# EAGLE design Shield_3up (EAGLE 9.4.0)
COMPANY: Unexpected Maker; DATE: 24-10-2018; DRAWN: Seon; REV: V1; TITLE: TinyPICO
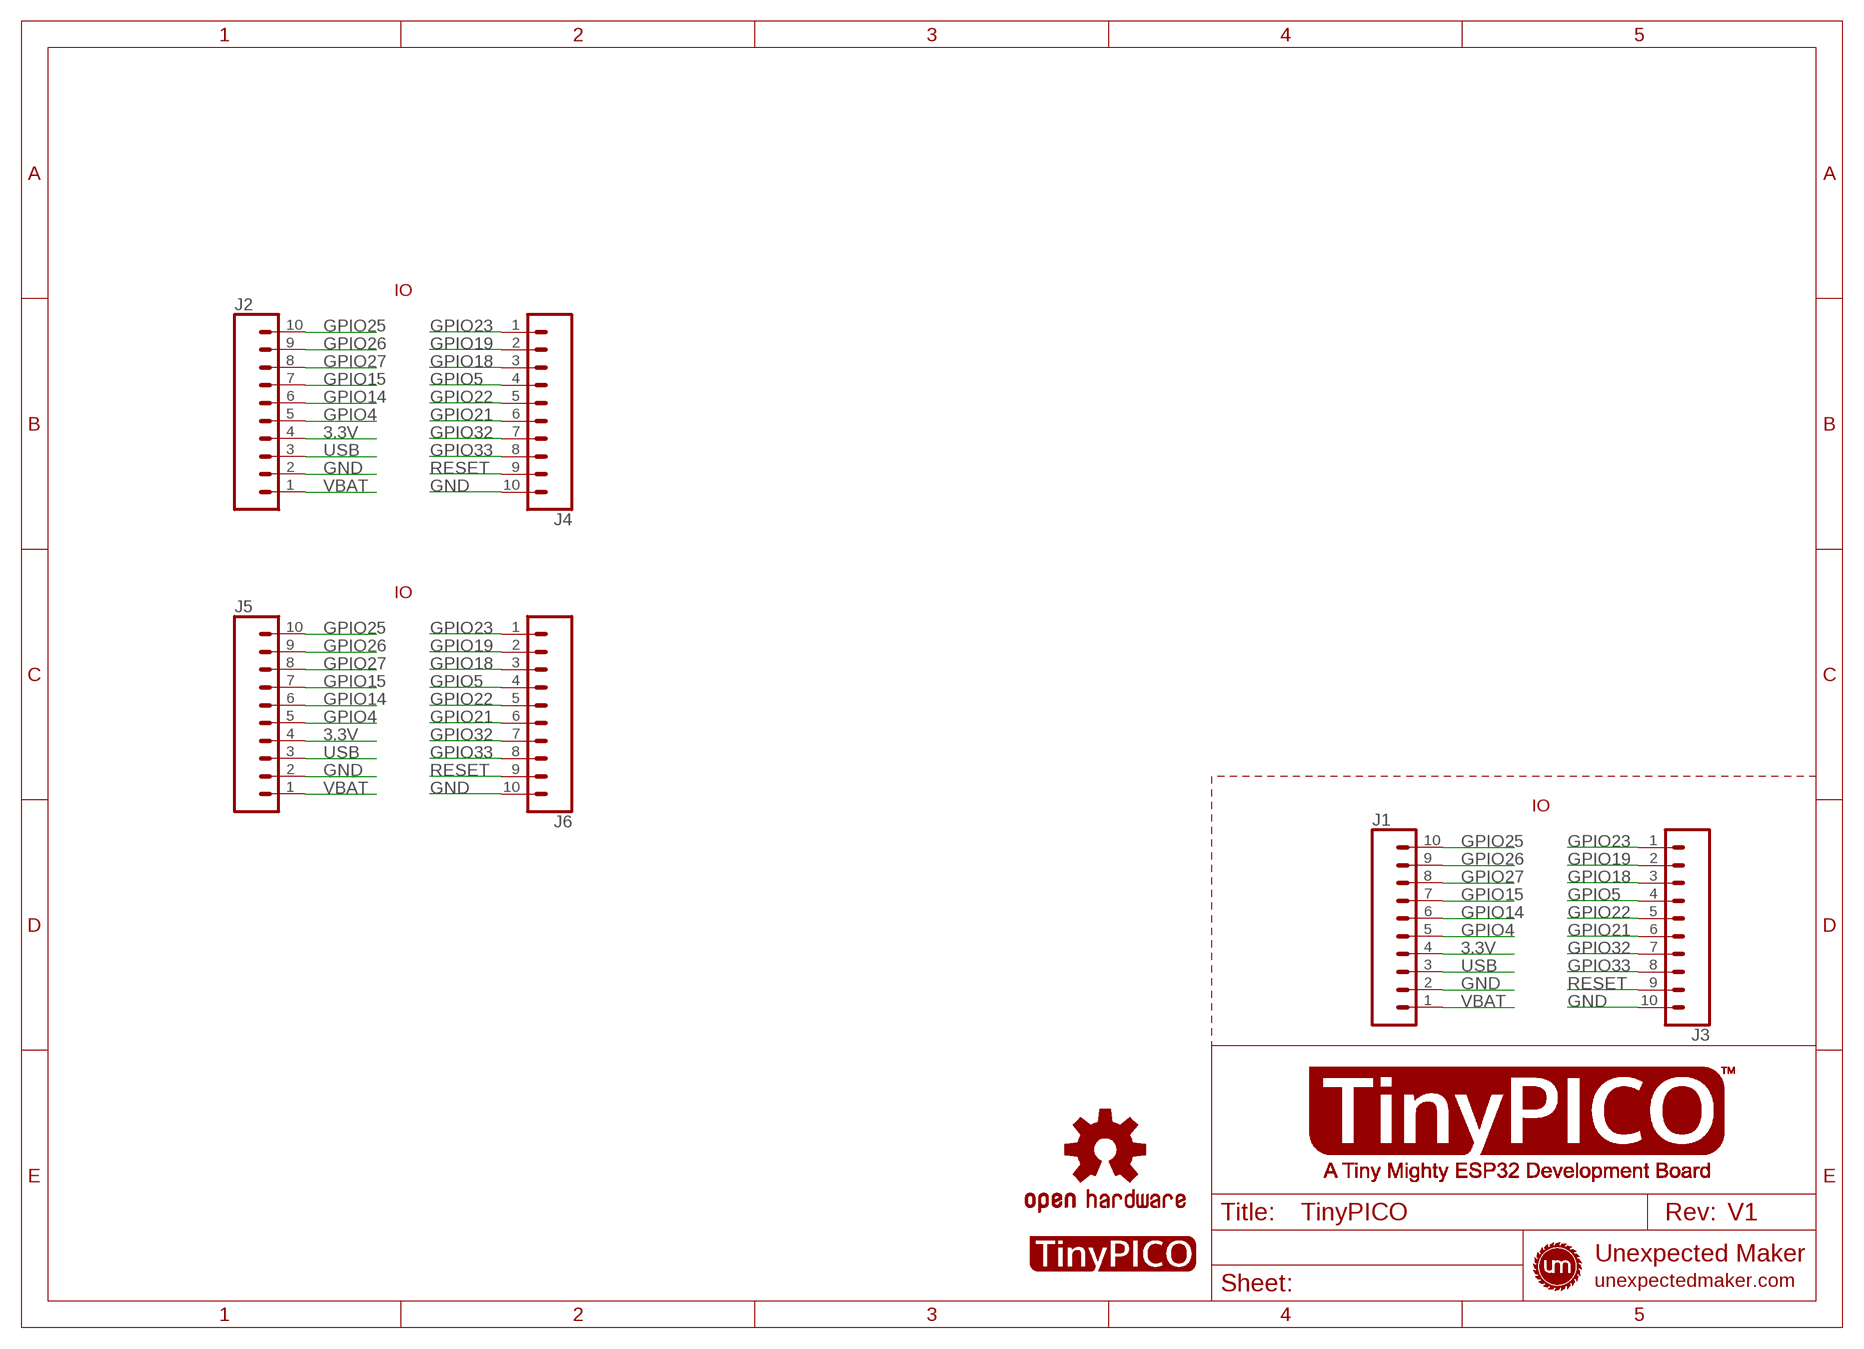
[diagram p0: schematic, sheet 1]

## Parts
J1  TINYPICO_HEADER_10NO_SILK_PTH_FEMALE  [1X10_NO_SILK]
J2  TINYPICO_HEADER_10NO_SILK_PTH_FEMALE  [1X10_NO_SILK]
J3  TINYPICO_HEADER_10NO_SILK_PTH_FEMALE  [1X10_NO_SILK]
J4  TINYPICO_HEADER_10NO_SILK_PTH_FEMALE  [1X10_NO_SILK]
J5  TINYPICO_HEADER_10NO_SILK_PTH_FEMALE  [1X10_NO_SILK]
J6  TINYPICO_HEADER_10NO_SILK_PTH_FEMALE  [1X10_NO_SILK]
LOGO1  OSHW-LOGOS  [OSHW-LOGO-S]
U$1  TP_LOGO  [TP_LOGO]

## Nets
3.3V: J1.4 J2.4 J5.4
GND: J1.2 J2.2 J3.10 J4.10 J5.2 J6.10
GPIO4: J1.5 J2.5 J5.5
GPIO5: J3.4 J4.4 J6.4
GPIO14: J1.6 J2.6 J5.6
GPIO15: J1.7 J2.7 J5.7
GPIO18: J3.3 J4.3 J6.3
GPIO19: J3.2 J4.2 J6.2
GPIO21: J3.6 J4.6 J6.6
GPIO22: J3.5 J4.5 J6.5
GPIO23: J3.1 J4.1 J6.1
GPIO25: J1.10 J2.10 J5.10
GPIO26: J1.9 J2.9 J5.9
GPIO27: J1.8 J2.8 J5.8
GPIO32: J3.7 J4.7 J6.7
GPIO33: J3.8 J4.8 J6.8
RESET: J3.9 J4.9 J6.9
USB: J1.3 J2.3 J5.3
VBAT: J1.1 J2.1 J5.1

## Notes on the sheet
- IO
- IO
- IO

## Library data of the parts
J1-J6 = UnexpectedMaker:TINYPICO_HEADER_10: Multi connection point. Often used as Generic Header-pin footprint for 0.1 inch spaced/style header connections On any of the 0.1 inch spaced packages, you can populate with these: Break Away Headers - Straight <https://www.sparkfun.com/products/116> (PRT-00116) Break Away Male Headers - Right Angle <https://www.sparkfun.com/products/553> (PRT-00553) Female Headers <https://www.sparkfun.com/products/115> (PRT-00115) Break Away Headers - Machine Pin <https://www.sparkfun.com/products/117> (PRT-00117) Break Away Female Headers - Swiss Machine Pin <https://www.sparkfun.com/products/743> (PRT-00743) Arduino Stackable Header - 10 Pin <https://www.sparkfun.com/products/11376> (PRT-11376) For SCREWTERMINALS and SPRING TERMINALS visit here: Screw Terimnals on SparkFun.com <https://www.sparkfun.com/search/results?term=Screw+Terminals> (5mm/3.5mm/2.54mm spacing) This device is also useful as a general connection point to wire up your design to another part of your project. Our various solder wires solder well into these plated through hole pads. Hook-Up Wire - Assortment (Stranded, 22 AWG) <https://www.sparkfun.com/products/11375> (PRT-11375) Hook-Up Wire - Assortment (Solid Core, 22 AWG) <https://www.sparkfun.com/products/11367> (PRT-11367) View the entire wire category on our website here <https://www.sparkfun.com/categories/141> Special notes: Molex polarized connector foot print use with SKU : PRT-08231 with associated crimp pins and housings. 1MM SMD Version SKU: PRT-10208 NOTES ON THE VARIANTS LOCK and LOCK_LONGPADS... This footprint was designed to help hold the alignment of a through-hole component (i.e. 6-pin header) while soldering it into place. You may notice that each hole has been shifted either up or down by 0.005 of an inch from it's more standard position (which is a perfectly straight line). This slight alteration caused the pins (the squares in the middle) to touch the edges of the holes. Because they are alternating, it causes a "brace" to hold the component in place. 0.005 has proven to be the perfect amount of "off-center" position when using our standard breakaway headers. Although looks a little odd when you look at the bare footprint, once you have a header in there, the alteration is very hard to notice. Also,if you push a header all the way into place, it is covered up entirely on the bottom side.; PROD_ID: CONN-11563
LOGO1 = SparkFun-Aesthetics:OSHW-LOGO: Open-Source Hardware (OSHW) Logo This logo indicates the piece of hardware it is found on incorporates a OSHW license and/or adheres to the definition of open source hardware found here: http://freedomdefined.org/OSHW
U$1 = UnexpectedMaker:TP_LOGO

## Board
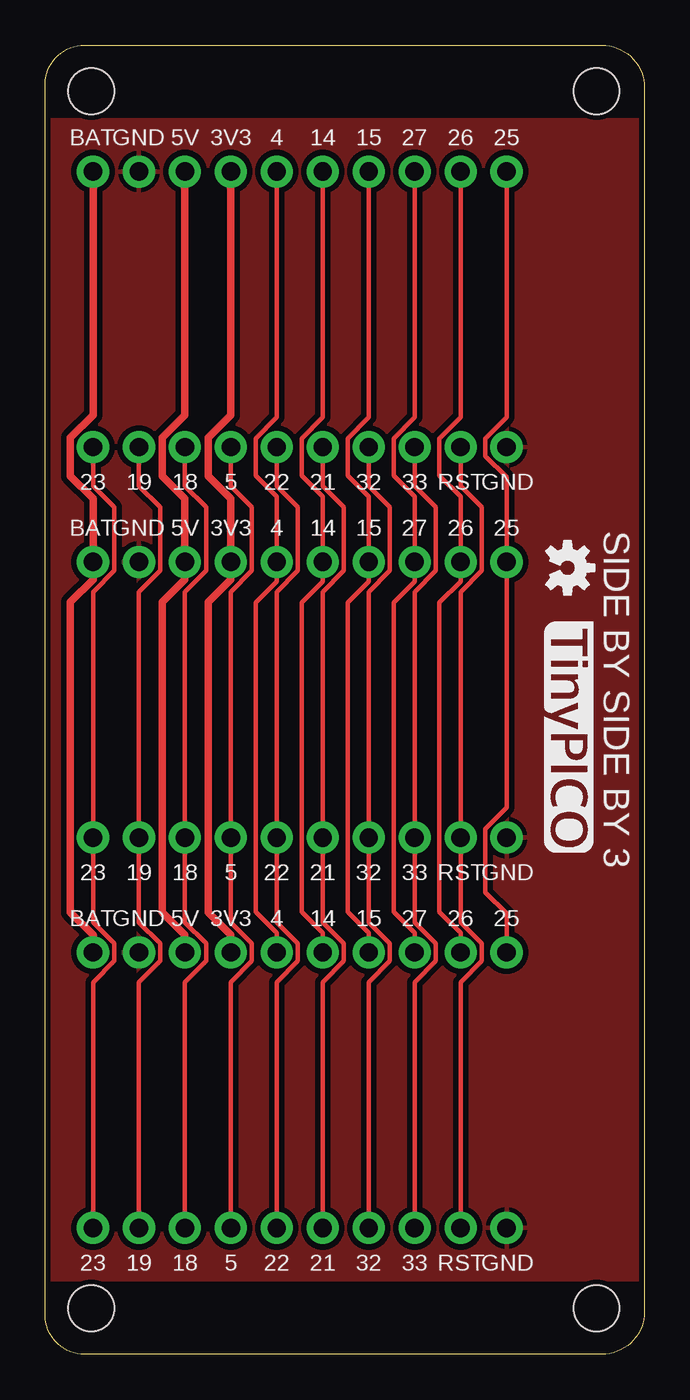
[diagram p1: board, top side]
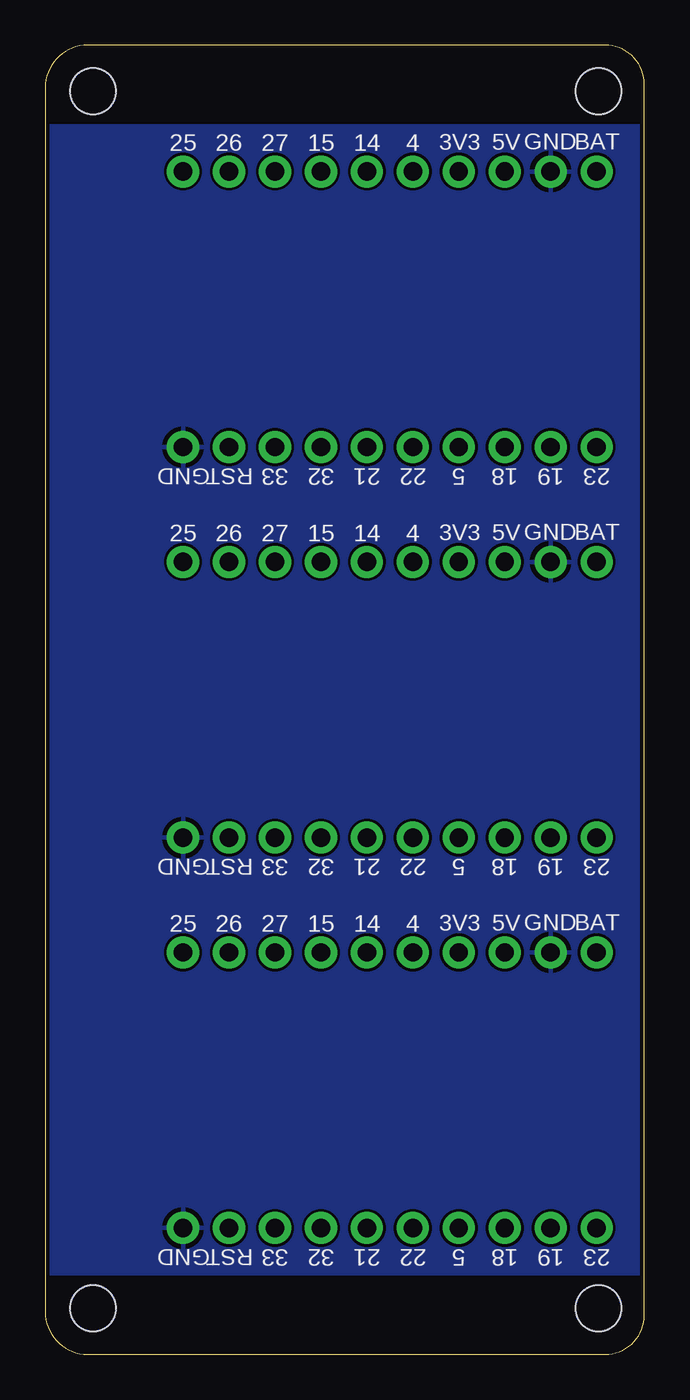
[diagram p2: board, bottom side, seen from below]

Size 33.12 x 72.39 mm. Coordinates in mm from the lower left corner, seen from the top.
Outline: 33.12,70.05 33.12,2.34 arc-90 30.78,0 2.17,0 arc-90 0,2.17 0,70.22 arc-90 2.17,72.39 30.78,72.39 arc-90 33.12,70.05
Copper layers (1*16): Top 0.035mm / dielectric 1.5mm / Bottom 0.035mm
Design rules "UnexpectedMaker_JLCPCB 2 Layer": minimum track width 6mil, minimum drill 10mil, track to track 6mil, track to pad 6mil, pad to pad 6mil, via to via 6mil, smd to smd 6mil, copper to edge 9mil, drill to drill 7mil, minimum pad ring 4mil, minimum via ring 4mil, stop-mask expansion 4mil, vias tented up to drill 25mil, thermal gap 10mil
Holes 2.54 mm at 2.54,2.54 30.48,2.54 30.48,69.85 2.54,69.85

### Footprints (pad centres in the part's own frame; a part is rotated, then mirrored left to right if it is on the bottom)
1X10_NO_SILK = drill 1.016 pad 1.778: 1 0,0; 2 2.54,0; 3 5.08,0; 4 7.62,0; 5 10.16,0; 6 12.7,0; 7 15.24,0; 8 17.78,0; 9 20.32,0; 10 22.86,0

### Placement (x,y rotation side)
J1  2.64,22.23 0 top
J2  2.64,65.41 0 top
J3  2.64,6.98 0 top
J4  2.64,50.16 0 top
J5  2.64,43.81 0 top
J6  2.64,28.57 0 top
LOGO1  28.87,43.49 270 top
U$1  29.21,34.29 180 bottom

### Tracks (layer width: path | path; a pad name or v marks a point on that pad's centre or on a via)
3.3V
  Top 0.406: J2.4 10.26,51.92 9.02,50.68 9.02,48.57 10.26,47.32 J5.4 10.26,42.84 9.02,41.6 9.02,24.44 10.26,23.2 J1.4
GND
  pour Top (isolate 0.305): -0.85,68.26 -0.85,4.11 33.44,4.11 33.44,68.26
  pour Bottom: 33.66,67.94 33.66,4.45 -1.27,4.45 -1.27,67.94
GPIO4
  Top 0.254: J2.5 12.8,51.82 11.63,50.65 11.63,48.6 12.8,47.43 J5.5 12.8,42.74 11.63,41.57 11.63,24.47 12.8,23.3 J1.5
GPIO5
  Top 0.254: J4.4 10.26,48.01 11.43,46.84 11.43,43.33 10.26,42.16 J6.4 10.26,23.88 11.43,22.71 11.43,21.74 10.26,20.57 J3.4
GPIO14
  Top 0.254: J2.6 15.34,51.82 14.17,50.65 14.17,48.6 15.34,47.43 J5.6 15.34,42.74 14.17,41.57 14.17,24.47 15.34,23.3 J1.6
GPIO15
  Top 0.254: J2.7 17.88,51.82 16.71,50.65 16.71,48.6 17.88,47.43 J5.7 17.88,42.74 16.71,41.57 16.71,24.47 17.88,23.3 J1.7
GPIO18
  Top 0.254: J4.3 7.72,48.01 8.89,46.84 8.89,43.33 7.72,42.16 J6.3 7.72,23.88 8.89,22.71 8.89,21.74 7.72,20.57 J3.3
GPIO19
  Top 0.254: J4.2 5.18,48.01 6.35,46.84 6.35,43.33 5.18,42.16 J6.2 5.18,23.88 6.35,22.71 6.35,21.74 5.18,20.57 J3.2
GPIO21
  Top 0.254: J4.6 15.34,48.01 16.51,46.84 16.51,43.33 15.34,42.16 J6.6 15.34,23.88 16.51,22.71 16.51,21.74 15.34,20.57 J3.6
GPIO22
  Top 0.254: J4.5 12.8,48.01 13.97,46.84 13.97,43.33 12.8,42.16 J6.5 12.8,23.88 13.97,22.71 13.97,21.74 12.8,20.57 J3.5
GPIO23
  Top 0.254: J4.1 2.64,48.01 3.81,46.84 3.81,43.33 2.64,42.16 J6.1 2.64,23.88 3.81,22.71 3.81,21.74 2.64,20.57 J3.1
GPIO25
  Top 0.254: J2.10 25.5,51.82 24.33,50.65 24.33,49.68 25.5,48.51 J5.10 25.5,30.23 24.33,29.06 24.33,25.55 25.5,24.38 J1.10
GPIO26
  Top 0.254: J2.9 22.96,51.82 21.79,50.65 21.79,48.6 22.96,47.43 J5.9 22.96,42.74 21.79,41.57 21.79,24.47 22.96,23.3 J1.9
GPIO27
  Top 0.254: J2.8 20.42,51.82 19.25,50.65 19.25,48.6 20.42,47.43 J5.8 20.42,42.74 19.25,41.57 19.25,24.47 20.42,23.3 J1.8
GPIO32
  Top 0.254: J4.7 17.88,48.01 19.05,46.84 19.05,43.33 17.88,42.16 J6.7 17.88,23.88 19.05,22.71 19.05,21.74 17.88,20.57 J3.7
GPIO33
  Top 0.254: J4.8 20.42,48.01 21.59,46.84 21.59,43.33 20.42,42.16 J6.8 20.42,23.88 21.59,22.71 21.59,21.74 20.42,20.57 J3.8
RESET
  Top 0.254: J4.9 22.96,48.01 24.13,46.84 24.13,43.33 22.96,42.16 J6.9 22.96,23.88 24.13,22.71 24.13,21.74 22.96,20.57 J3.9
USB
  Top 0.406: J2.3 7.72,51.92 6.48,50.68 6.48,48.57 7.72,47.32 J5.3 7.72,42.84 6.48,41.6 6.48,24.44 7.72,23.2 J1.3
VBAT
  Top 0.406: J2.1 2.64,51.92 1.4,50.68 1.4,48.57 2.64,47.32 J5.1 2.64,42.84 1.4,41.6 1.4,24.44 2.64,23.2 J1.1

### Text on the board
tPlace: SIDE BY SIDE BY 3
tNames: BAT | GND | 5V | 3V3 | 4 | 14 | 15 | 27 | 26 | 25 | 23 | 19 | 18 | 5 | 22 | 21 | 32 | 33 | RST | GND | BAT | GND | 5V | 3V3 | 4 | 14 | 15 | 27 | 26 | 25 | 23 | 19 | 18 | 5 | 22 | 21 | 32 | 33 | RST | GND | BAT | GND | 5V | 3V3 | 4 | 14 | 15 | 27 | 26 | 25 | 23 | 19 | 18 | 5 | 22 | 21 | 32 | 33 | RST | GND
bNames: BAT | GND | 5V | 3V3 | 4 | 14 | 15 | 27 | 26 | 25 | 23 | 19 | 18 | 5 | 22 | 21 | 32 | 33 | RST | GND | 4 | 14 | 15 | 27 | 26 | 25 | BAT | GND | 5V | 3V3 | RST | GND | 23 | 19 | 18 | 5 | 22 | 21 | 32 | 33 | BAT | GND | 5V | 3V3 | 4 | 14 | 15 | 27 | 26 | 25 | 23 | 19 | 18 | 5 | 22 | 21 | 32 | 33 | RST | GND